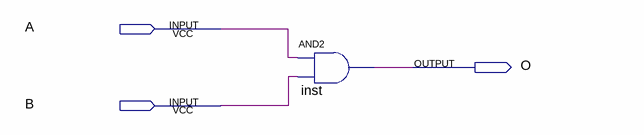
[diagram p0: schematic sheet]
// Quartus schematic CongAND.bdf as structural Verilog: 1 symbols, 3 pins
module CongAND (
  input  A,
  input  B,
  output O
);

  and inst (O, A, B);
endmodule
